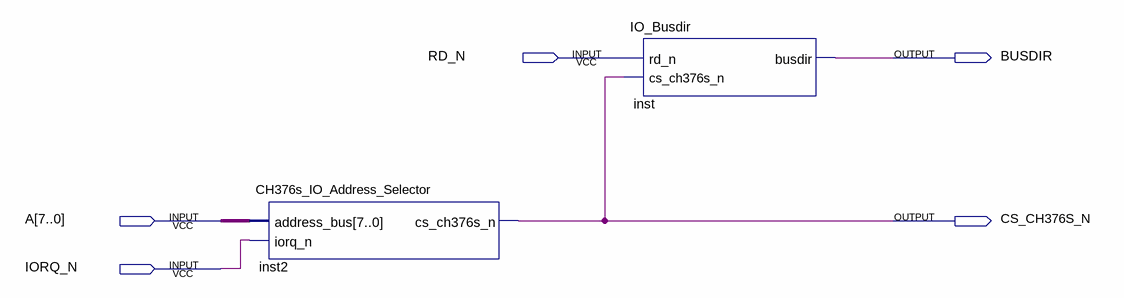
[diagram p0: schematic sheet]
// Quartus schematic msxusb.bdf as structural Verilog: 2 symbols, 5 pins
module msxusb (
  input  RD_N,
  input  [7:0] A,
  input  IORQ_N,
  output BUSDIR,
  output CS_CH376S_N
);

  CH376s_IO_Address_Selector inst2 (.address_bus(A), .iorq_n(IORQ_N), .cs_ch376s_n(CS_CH376S_N));
  IO_Busdir inst (.rd_n(RD_N), .cs_ch376s_n(CS_CH376S_N), .busdir(BUSDIR));
endmodule
